# Altium schematic sheet 1_Power_Supply.SchDoc
size A4
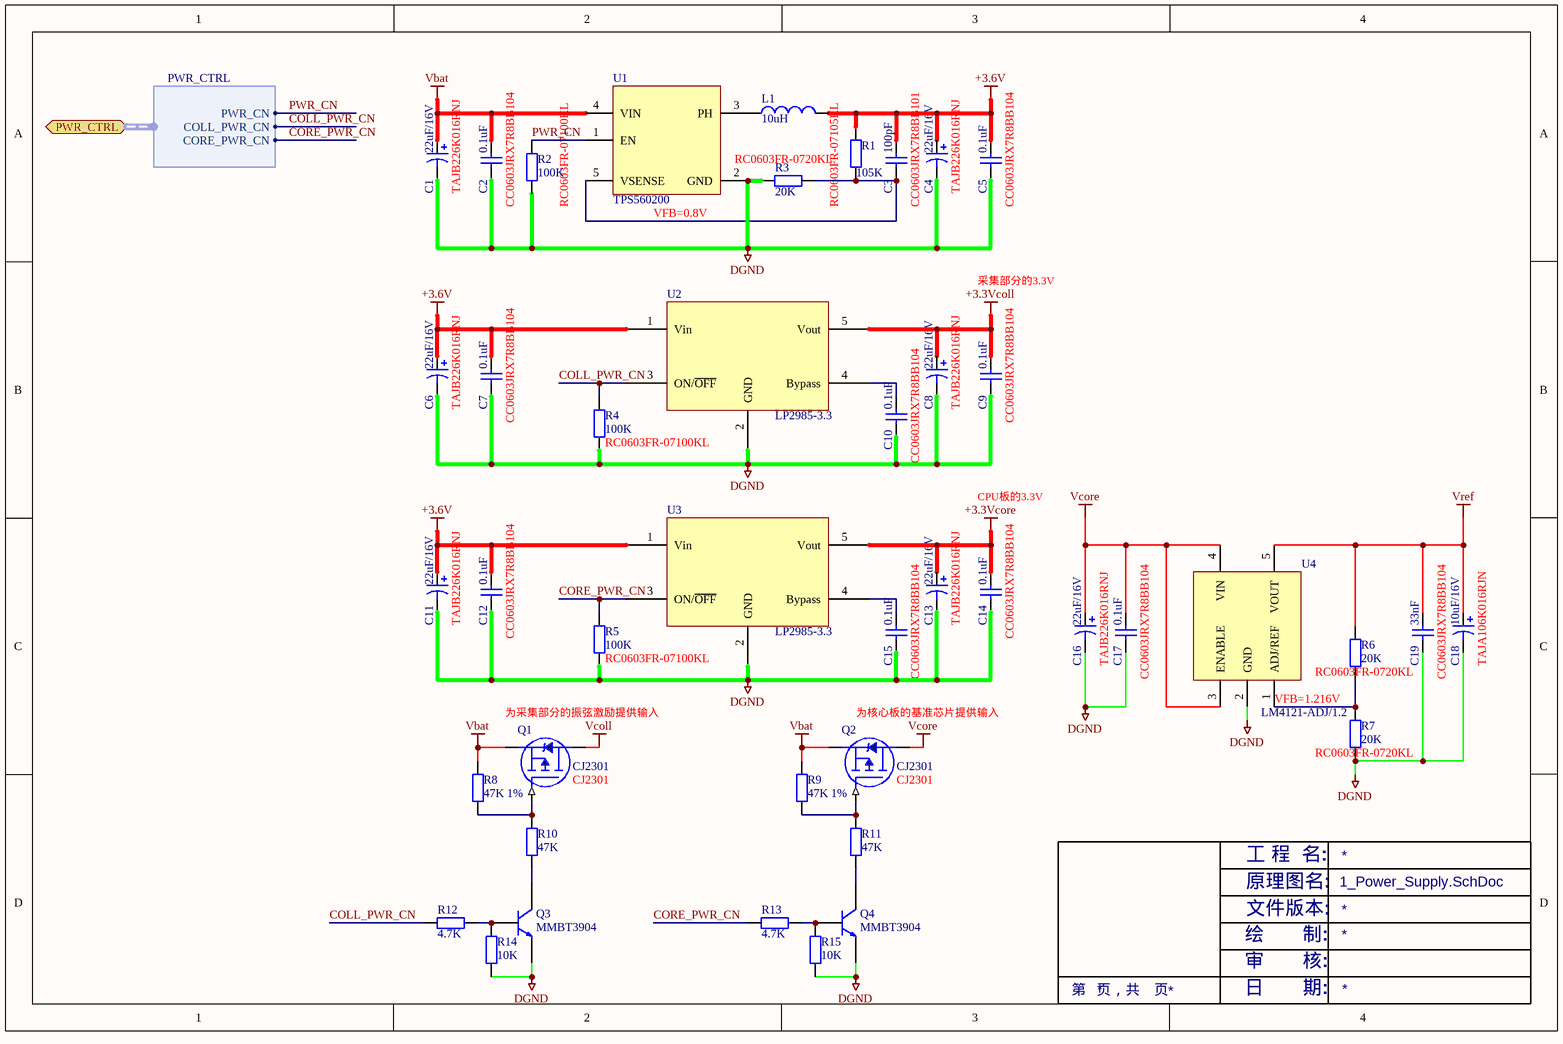
[diagram p0: 1_Power_Supply.SchDoc]

## Parts
C1  22uF/16V  Part No.: TAJB226K016RNJ  [CB3528]
C2  0.1uF  Type No.: CC0603JRX7R8BB104  [CC0603]
C3  100pF  Type No.: CC0603JRX7R8BB101  [CC0603]
C4  22uF/16V  Part No.: TAJB226K016RNJ  [CB3528]
C5  0.1uF  Type No.: CC0603JRX7R8BB104  [CC0603]
C6  22uF/16V  Part No.: TAJB226K016RNJ  [CB3528]
C7  0.1uF  Type No.: CC0603JRX7R8BB104  [CC0603]
C8  22uF/16V  Part No.: TAJB226K016RNJ  [CB3528]
C9  0.1uF  Type No.: CC0603JRX7R8BB104  [CC0603]
C10  0.1uF  Type No.: CC0603JRX7R8BB104  [CC0603]
C11  22uF/16V  Part No.: TAJB226K016RNJ  [CB3528]
C12  0.1uF  Type No.: CC0603JRX7R8BB104  [CC0603]
C13  22uF/16V  Part No.: TAJB226K016RNJ  [CB3528]
C14  0.1uF  Type No.: CC0603JRX7R8BB104  [CC0603]
C15  0.1uF  Type No.: CC0603JRX7R8BB104  [CC0603]
C16  22uF/16V  Part No.: TAJB226K016RNJ  [CB3528]
C17  0.1uF  Type No.: CC0603JRX7R8BB104  [CC0603]
C18  10uF/16V  Type No.: TAJA106K016RJN  [CA3216]
C19  33nF  Type No.: CC0603JRX7R8BB104  [CC0603]
L1  10uH  [SLF6025]
Q1  CJ2301  [SOT-23W]
Q2  CJ2301  [SOT-23W]
Q3  MMBT3904  [SOT-23W]
Q4  MMBT3904  [SOT-23W]
R1  105K  Type No.: RC0603FR-07105KL  [CC0603]
R2  100K  Type No.: RC0603FR-07100KL  [CC0603]
R3  20K  Type No.: RC0603FR-0720KL  [CC0603]
R4  100K  Type No.: RC0603FR-07100KL  [CC0603]
R5  100K  Type No.: RC0603FR-07100KL  [CC0603]
R6  20K  Type No.: RC0603FR-0720KL  [CC0603]
R7  20K  Type No.: RC0603FR-0720KL  [CC0603]
R8  47K 1%  [CC0603]
R9  47K 1%  [CC0603]
R10  47K  [CC0603]
R11  47K  [CC0603]
R12  4.7K  [CC0603]
R13  4.7K  [CC0603]
R14  10K  [CC0603]
R15  10K  [CC0603]
U1  TPS560200  [SOT-23-5]
U2  LP2985-3.3  [SOT-23-5]
U3  LP2985-3.3  [SOT-23-5]
U4  LM4121-ADJ/1.2  [SOT-23-5]

## Ports
PWR_CTRL (harness PWR_CTRL)

## Harnesses
PWR_CTRL: PWR_CN, COLL_PWR_CN, CORE_PWR_CN

## Nets
+3.3Vcoll: C8.1 C9.2 U2.5(Vout)
+3.3Vcore: C13.1 C14.2 U3.5(Vout)
+3.6V: C3.2 C4.1 C5.2 C6.1 C7.2 C11.1 C12.2 L1.2 R1.1 U2.1(Vin) U3.1(Vin)
DGND: C1.2 C2.1 C4.2 C5.1 C6.2 C7.1 C8.2 C9.1 C10.1 C11.2 C12.1 C13.2 C14.1 C15.1 C16.2 C17.1 C18.2 C19.1 Q3.2 Q4.2 R2.2 R3.2 R4.2 R5.2 R7.2 R14.2 R15.2 U1.2(GND) U2.2(GND) U3.2(GND) U4.2(GND)
Vbat: C1.1 C2.2 Q1.2(SOURCE) Q2.2(SOURCE) R8.1 R9.1 U1.4(VIN)
Vcoll: Q1.3(DRAIN)
Vcore: C16.1 C17.2 Q2.3(DRAIN) U4.3(ENABLE) U4.4(VIN)
Vref: C18.1 C19.2 R6.1 U4.5(VOUT)
COLL_PWR_CN: R4.1 R12.1 U2.3(ON/~{OFF}) ; port PWR_CTRL.COLL_PWR_CN
CORE_PWR_CN: R5.1 R13.1 U3.3(ON/~{OFF}) ; port PWR_CTRL.CORE_PWR_CN
PWR_CN: R2.1 U1.1(EN) ; port PWR_CTRL.PWR_CN
NetC3_1: C3.1 R1.2 R3.1 U1.5(VSENSE)
NetC10_2: C10.2 U2.4(Bypass)
NetC15_2: C15.2 U3.4(Bypass)
NetL1_1: L1.1 U1.3(PH)
NetQ1_1: Q1.1(GATE) R8.2 R10.1
NetQ2_1: Q2.1(GATE) R9.2 R11.1
NetQ3_1: Q3.1 R12.2 R14.1
NetQ3_3: Q3.3 R10.2
NetQ4_1: Q4.1 R13.2 R15.1
NetQ4_3: Q4.3 R11.2
NetR6_2: R6.2 R7.1 U4.1(ADJ/REF)

## Notes on the sheet
- (near U1) VFB=0.8V
- 采集部分的3.3V
- CPU板的3.3V
- (near Q1) 为采集部分的振弦激励提供输入
- (near Q2) 为核心板的基准芯片提供输入
- (near U4) VFB=1.216V
- 文件版本:
- 原理图名:
- 工 程  名:
- 绘       制:
- 审       核:
- 第   页，共    页
- 日       期:

## Library data of the parts
C1 C4 C6 C8 C11 C13 C16 C18 = Cap Pol1: Polarized Capacitor (Radial)
C2 C3 C5 C7 C9 C10 C12 C14 C15 C17 C19 = Cap: Capacitor
L1 = Inductor: Code_IEC: 1005; Value: 10mH; Published: 8-Jun-2000; LatestRevisionDate: 29-May-2009; LatestRevisionNote: IPC-7351 Footprint Added.; PackageReference: 0402-A; Publisher: Altium Limited; PackageDescription: Chip Inductor; Code_JEITA: 0402
Q1 Q2 = P-MOSFET1: Type No.: CJ2301
Q3 Q4 = NPN
R1-R7 R14 R15 = Res2: Resistor
  R14 R15: Published: 8-Jun-2000; LatestRevisionDate: 17-Jul-2002; LatestRevisionNote: Re-released for DXP Platform.; PackageReference: AXIAL-0.4; Publisher: Altium Limited; PackageDescription: Axial Device, Thru-Hole; 2 Leads; 0.4 in Pin Spacing; Value: 10K
R8-R13 = Res2: Resistor; Value: 10K; Published: 8-Jun-2000; LatestRevisionDate: 17-Jul-2002; LatestRevisionNote: Re-released for DXP Platform.; PackageReference: AXIAL-0.4; Publisher: Altium Limited; PackageDescription: Axial Device, Thru-Hole; 2 Leads; 0.4 in Pin Spacing
U2 U3 = LP2985